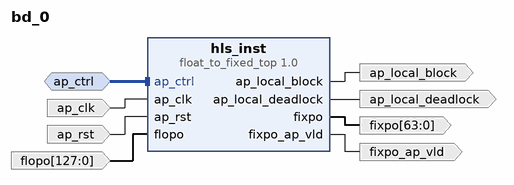
[diagram p0: block diagram of the top level]
# Vivado block design bd_0, xc7z020clg400-1, Vivado 2021.2
create_bd_design bd_0

create_bd_intf_port -mode Slave -vlnv xilinx.com:interface:acc_handshake_rtl:1.0 ap_ctrl
create_bd_port -dir I -type clk ap_clk
set_property -dict {CONFIG.FREQ_HZ 20000000.0} [get_bd_ports ap_clk]
create_bd_port -dir O ap_local_block
create_bd_port -dir O ap_local_deadlock
create_bd_port -dir I -type rst ap_rst
set_property -dict {CONFIG.POLARITY ACTIVE_HIGH} [get_bd_ports ap_rst]
create_bd_port -dir O -from 63 -to 0 -type data fixpo
create_bd_port -dir O fixpo_ap_vld
create_bd_port -dir I -from 127 -to 0 -type data flopo

create_bd_cell -type ip -vlnv xilinx.com:hls:float_to_fixed_top:1.0 hls_inst

# ---- connections ----

connect_bd_intf_net -intf_net ap_ctrl_0_1 [get_bd_intf_ports ap_ctrl] [get_bd_intf_pins hls_inst/ap_ctrl]
connect_bd_net -net ap_clk_0_1 [get_bd_ports ap_clk] [get_bd_pins hls_inst/ap_clk]
connect_bd_net -net ap_rst_0_1 [get_bd_ports ap_rst] [get_bd_pins hls_inst/ap_rst]
connect_bd_net -net flopo_0_1 [get_bd_ports flopo] [get_bd_pins hls_inst/flopo]
connect_bd_net [get_bd_pins hls_inst/ap_local_block] [get_bd_ports ap_local_block]
connect_bd_net [get_bd_pins hls_inst/ap_local_deadlock] [get_bd_ports ap_local_deadlock]
connect_bd_net [get_bd_pins hls_inst/fixpo] [get_bd_ports fixpo]
connect_bd_net [get_bd_pins hls_inst/fixpo_ap_vld] [get_bd_ports fixpo_ap_vld]

validate_bd_design
save_bd_design
